# Altium schematic sheet Power.SchDoc
size A3
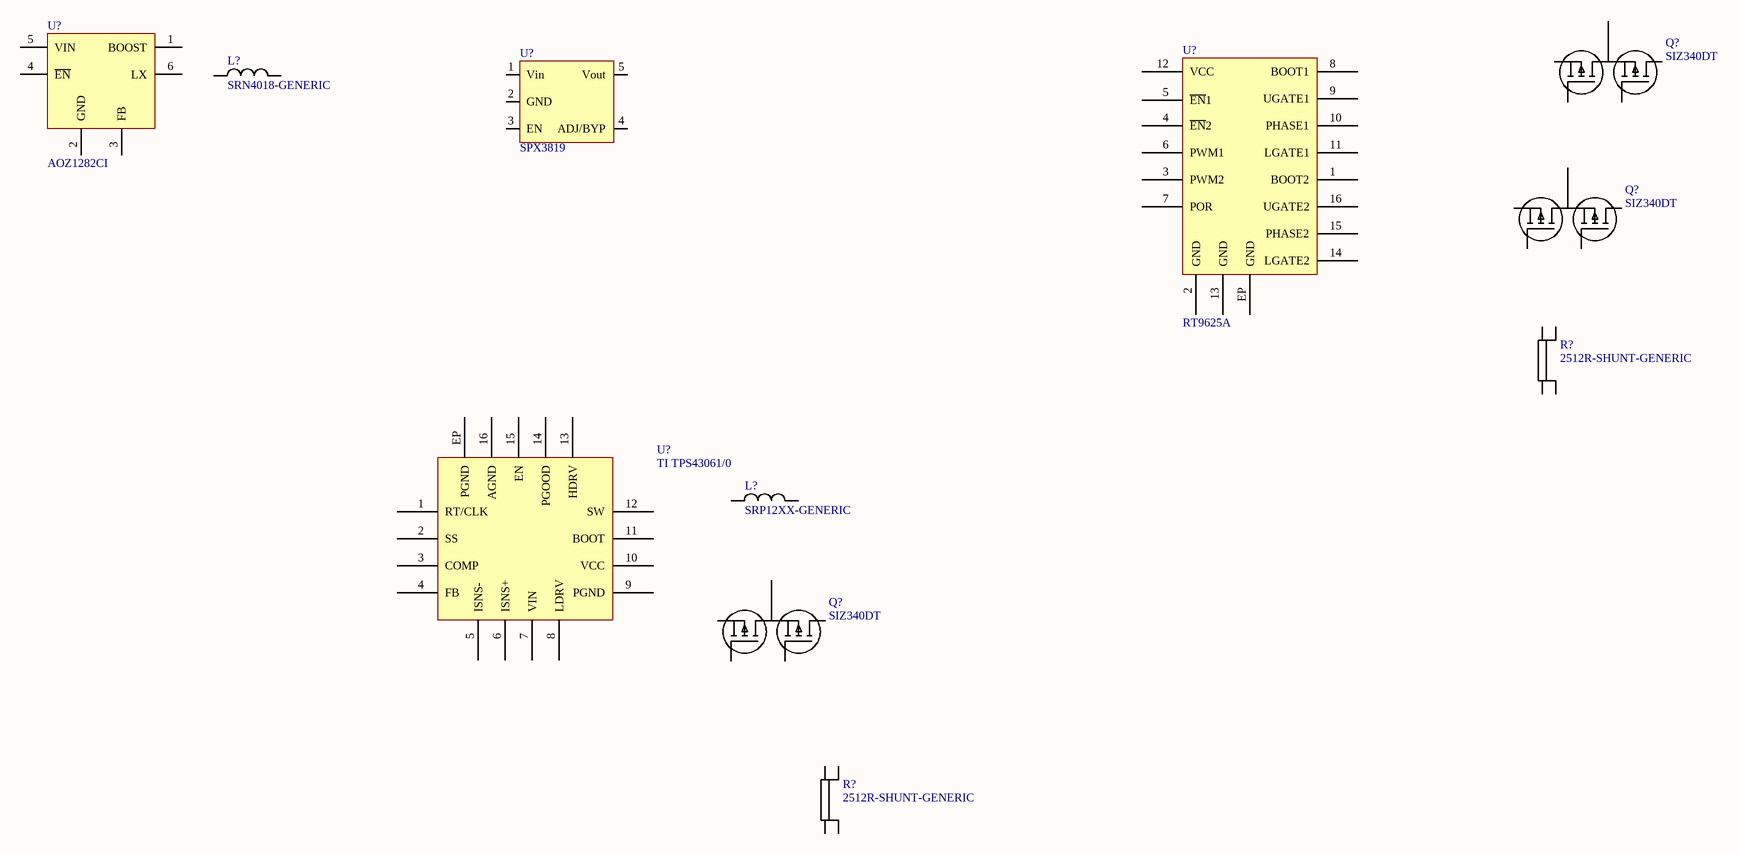
[diagram p0: Power.SchDoc]

## Parts
(Parts that share a designator on the sheet are numbered #1, #2 ... from top to bottom, then left to right.)
L?#1  SRN4018-GENERIC  [SRN4018]
L?#2  SRP12XX-GENERIC  [SRP1250]
Q?#1  SIZ340DT  [PowerPAIR  3 x 3]
Q?#2  SIZ340DT  [PowerPAIR  3 x 3]
Q?#3  SIZ340DT  [PowerPAIR  3 x 3]
R?#1  2512R-SHUNT-GENERIC  [2512R-SHUNT]  (net tie, no BOM)
R?#2  2512R-SHUNT-GENERIC  [2512R-SHUNT]  (net tie, no BOM)
U?#1  AOZ1282CI  [SOT23-6]
U?#2  SPX3819  [SOT-23-5]
U?#3  RT9625A  [WQFN-16L 4x4 0.65mm]
U?#4  TI TPS43061/0  [S-PWQFN-N16]

## Nets

Not connected (* = marked no-connect by the designer): L?#1 1 2; L?#2 1 2; Q?#1 D1 D2S1 G1 G2 S2; Q?#2 D1 D2S1 G1 G2 S2; Q?#3 D1 D2S1 G1 G2 S2; R?#1 1 2 3 4; R?#2 1 2 3 4; U?#1 1(BOOST) 2(GND) 3(FB) 4(~{EN}) 5(VIN) 6(LX); U?#2 1(Vin) 2(GND) 3(EN) 4(ADJ/BYP) 5(Vout); U?#3 1(BOOT2) 2(GND) 3(PWM2) 4(~{EN}2) 5(~{EN}1) 6(PWM1) 7(POR) 8(BOOT1) 9(UGATE1) 10(PHASE1) 11(LGATE1) 12(VCC) 13(GND) 14(LGATE2) 15(PHASE2) 16(UGATE2) EP(GND); U?#4 1(RT/CLK) 2(SS) 3(COMP) 4(FB) 5(ISNS-) 6(ISNS+) 7(VIN) 8(LDRV) 9(PGND) 10(VCC) 11(BOOT) 12(SW) 13(HDRV) 14(PGOOD) 15(EN) 16(AGND) EP(PGND)

## Library data of the parts
L?#1 = SRN4018-GENERIC: BOURNS SRN4018 Series Inductor
L?#2 = SRP12XX-GENERIC: BOURNS SRP12XX Series Inductor
Q?#1-Q?#3 = SIZ340DT: Dual N Channel MOSFET
R?#1 R?#2 = 2512R-SHUNT-GENERIC: GENERIC SHUNT RESISTOR 2512; Reel: *
U?#1 = AOZ1282CI: 1.2A 36V Buck Regulator SOT-23-6
U?#2 = SPX3819: SOT23-5 3v3
U?#3 = RT9625A: 24V Dual Half Bridge Driver
U?#4 = TI TPS43061/0: Synchronous Boost Converter